# EasyEDA Pro project ProPrj_ 基于stm32制作的PAW3395鼠标_2025-03-07.epro

# Schematic Schematic1
Create Date: 2024-05-16; Page Name: P1; Project Name: 鼠标终极板; Schematic Name: Schematic1; Update Date: 2024-05-30; Company: 嘉立创EDA; Page Size: A4; Version: V1.0
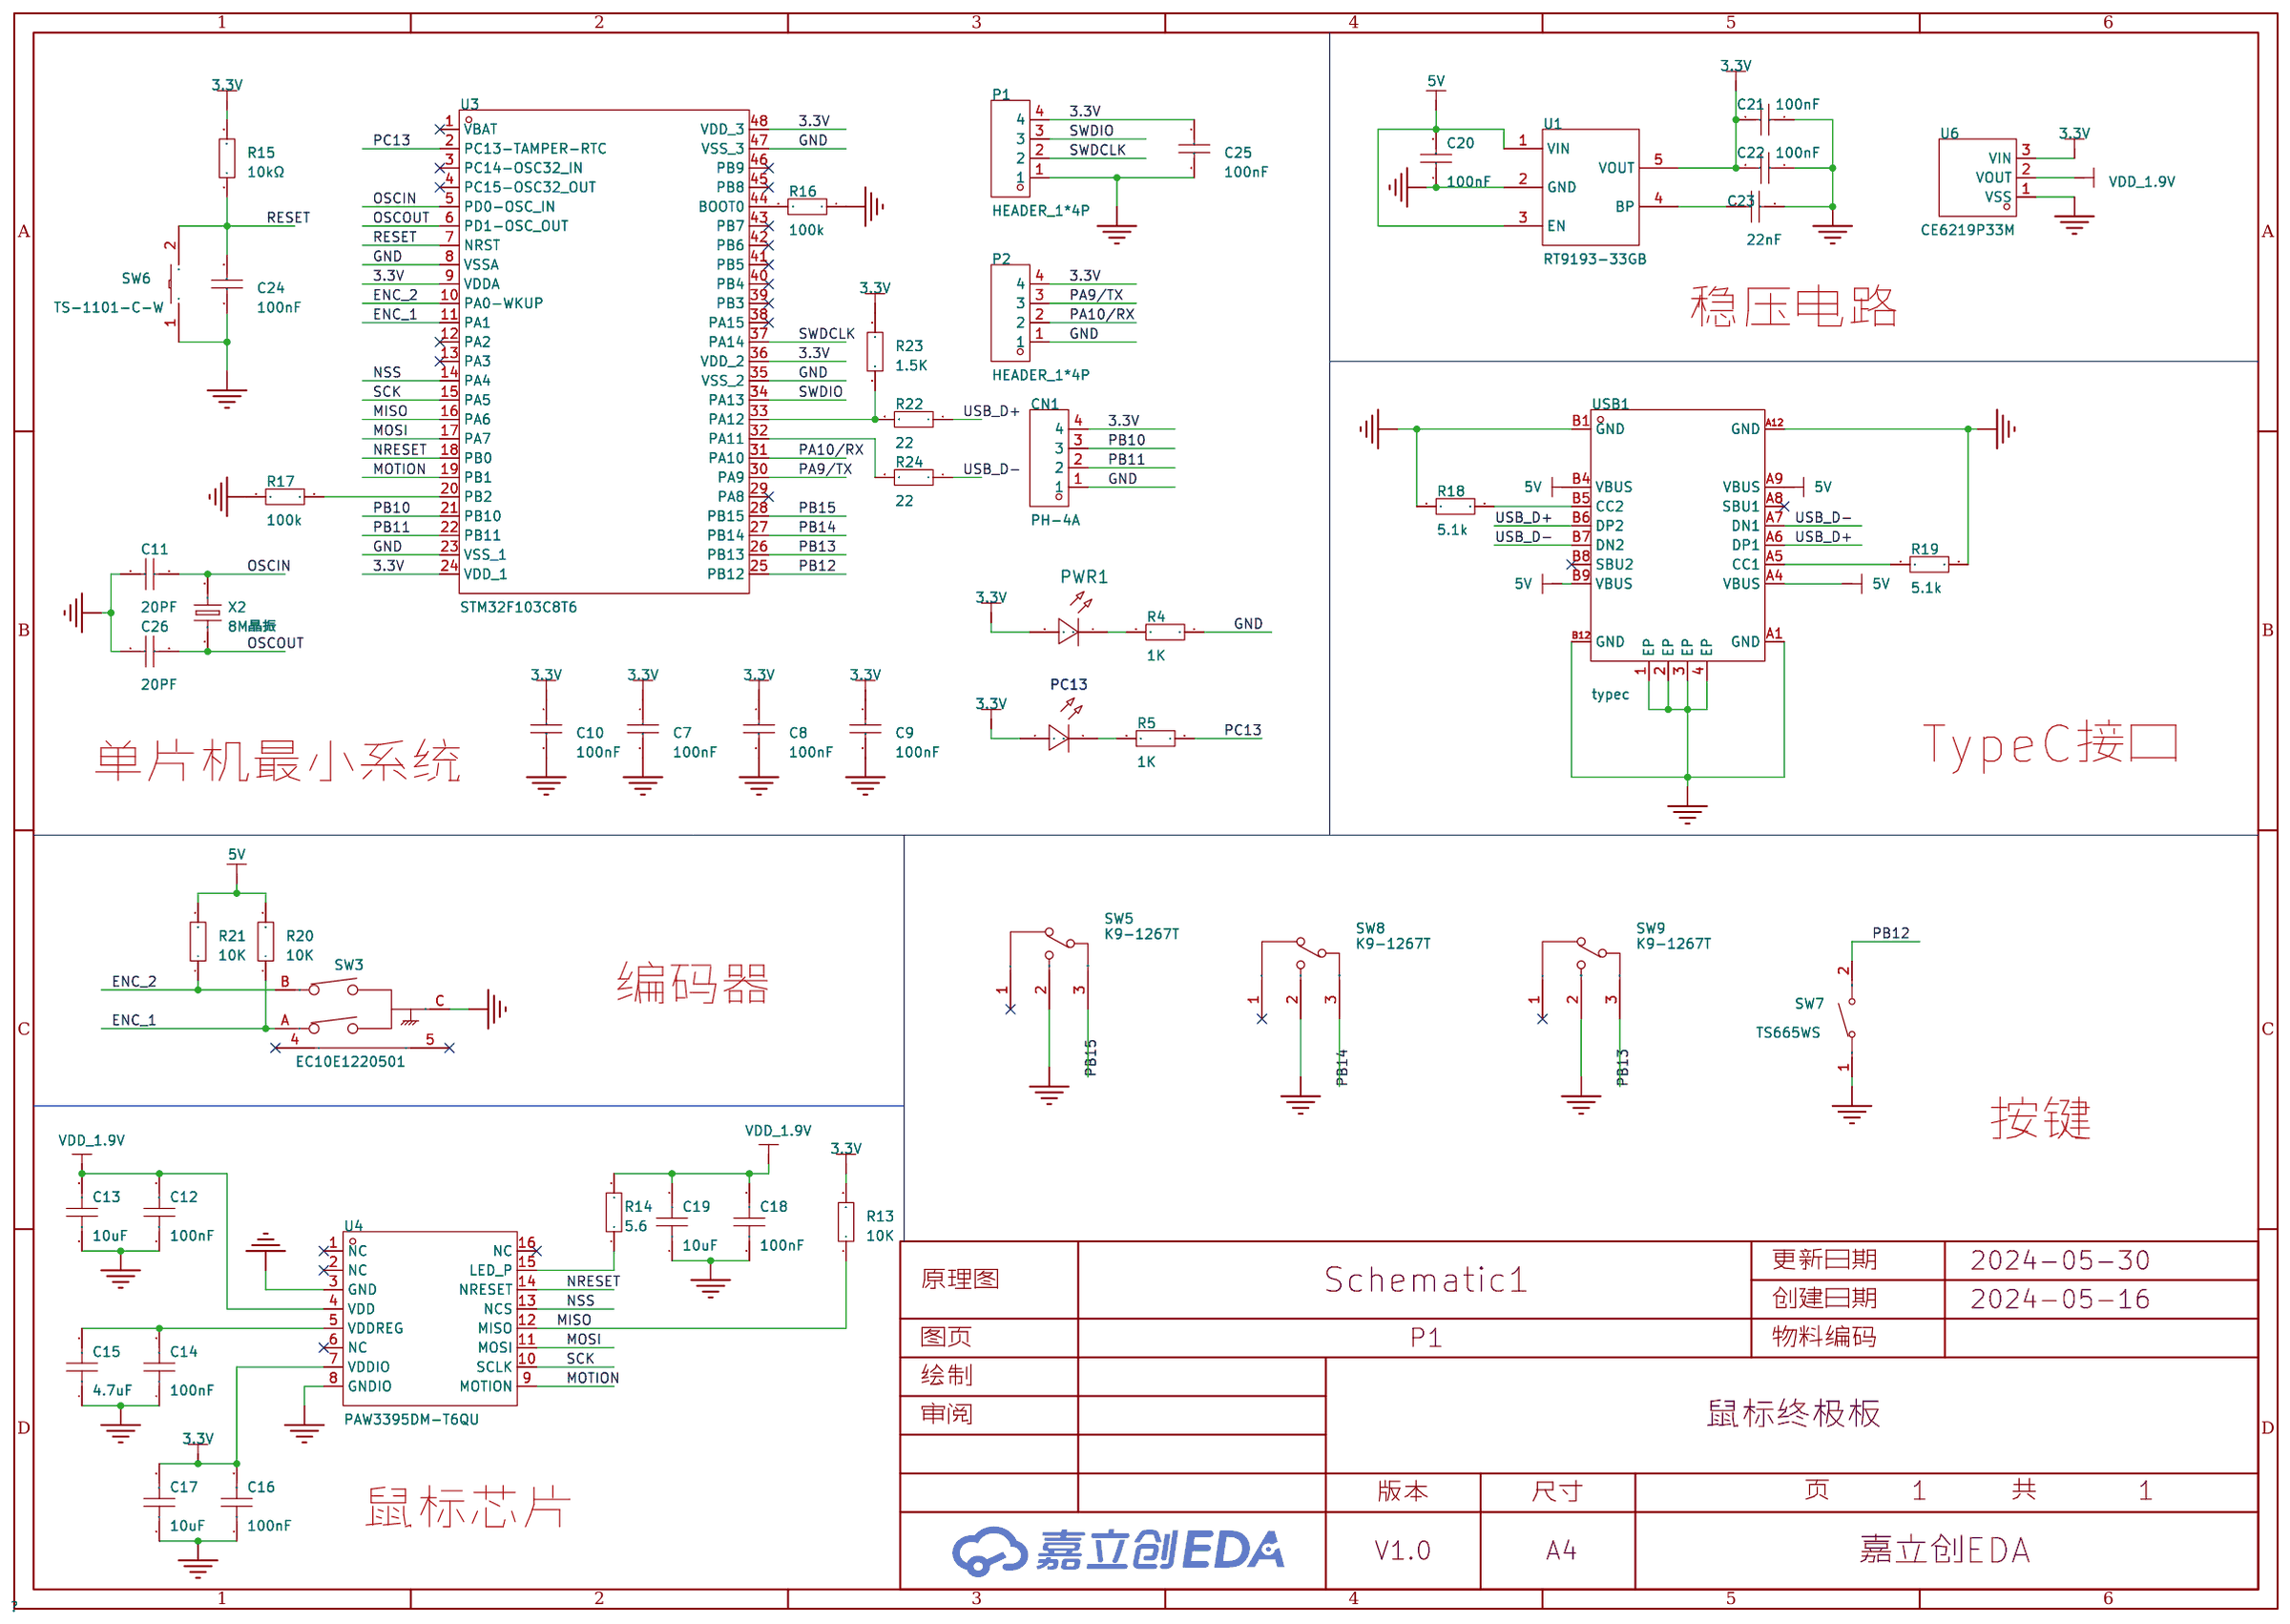
[diagram p0: schematic sheet]

## Parts
C7  100nF  [C0603]
C8  100nF  [C0603]
C9  100nF  [C0603]
C10  100nF  [C0603]
C11  20PF  [C0603]
C12  100nF  [C0603]
C13  10uF  [C0603]
C14  100nF  [C0603]
C15  4.7uF  [C0603]
C16  100nF  [C0603]
C17  10uF  [C0603]
C18  100nF  [C0603]
C19  10uF  [C0603]
C20  100nF  [C0603]
C21  100nF  [C0603]
C22  100nF  [C0603]
C23  22nF  [C0603]
C24  100nF  [C0603]
C25  100nF  [C0603]
C26  20PF  [C0603]
CN1  PH-4A  [CONN-TH_4P-P2.00_PH-4A_C2908625]
P1  HEADER_1*4P  [HDR-TH_4P-P2.54-V-M-1]
P2  HEADER_1*4P  [HDR-TH_4P-P2.54-V-M-1]
PC13  -  [LED_0603]
PWR1  -  [LED_0603]
R4  1K  [R0603]
R5  1K  [R0603]
R13  10K  [R0603]
R14  5.6  [R0603]
R15  10kΩ  [R0603]
R16  100k  [R0603]
R17  100k  [R0603]
R18  5.1k  [R0603]
R19  5.1k  [R0603]
R20  10K  [R0603]
R21  10K  [R0603]
R22  22  [R0603]
R23  1.5K  [R0603]
R24  22  [R0603]
SW3  EC10E1220501  [SW-TH_EC10EXXXXXXX]
SW5  K9-1267T  [SW-TH_K9-1267T]
SW6  TS-1101-C-W  [SW-SMD_L6.0-W3.3-LS8.0]
SW7  TS665WS  [SW-SMD_L6.0-W6.0-LS6.6]
SW8  K9-1267T  [SW-TH_K9-1267T]
SW9  K9-1267T  [SW-TH_K9-1267T]
U1  RT9193-33GB  [SOT-23-5_L3.0-W1.7-P0.95-LS2.8-BL]
U3  STM32F103C8T6  [LQFP-48_L7.0-W7.0-P0.50-LS9.0-BL]
U4  PAW3395DM-T6QU  [DIP-16_PAW3395DM-T6QU]
U6  CE6219P33M  [SOT-23-3_L2.9-W1.6-P1.90-LS2.8-BR]
USB1  typec  [USB-C-SMD_KH-TYPE-C-16P]
X2  8M晶振  [HC-49US_L11.5-W4.5-P4.88]

## Library data of the parts
C7-C11 C20-C26 = 0603B104K500NT: 容值:100nF;精度:±10%;额定电压:50V;材质(温度系数):X7R;; LCSC Part Name: 100nF ±10% 50V; Supplier Part: C30926; Manufacturer: FH(风华); Supplier Footprint: 0603; JLCPCB Part Class: 扩展库; Datasheet: https://atta.szlcsc.com/upload/public/pdf/source/20170923/C30926_1506149436298988724.pdf; Supplier: LCSC; Tolerance: ±10%; Voltage Rated: 50V; Temperature Coefficient: X7R
C12-C19 = CAP_0603: Supplier Footprint: 0603
CN1 = PH-4A_C2908625: 插针结构:1x4P;间距:2mm;安装方式:直插;参考系列:PH;总PIN数:4P;排数:1;每排PIN数:4;行距:-;额定电流:2A;触头材质:黄铜;触头镀层:锡;工作温度范围:-25℃~+85℃;; LCSC Part Name: 1x4P 间距:2mm 直插 系列:PH; Supplier Part: C2908625; Manufacturer: HCTL(华灿天禄); Supplier Footprint: 插件,P=2mm; JLCPCB Part Class: 扩展库; Datasheet: https://atta.szlcsc.com/upload/public/pdf/source/20230707/BA576CECAD32FECA9ECBAF2430E681CE.pdf; Supplier: LCSC; Pins Structure: 1x4P; Pitch: 2mm; Mounting Style: 直插; Reference Series: PH; Number of Pins: 4P; Number of Rows: 1; Number of PINs Per Row: 4; Current Rating (Max): 2A; Contact Material: 黄铜; Contact Plating: 锡; Operating Temperature Range: -25℃~+85℃
P1 P2 = HEADER_1*4P: Supplier Part: C9900003200; Supplier Footprint: TH-4P; JLCPCB Part Class: 扩展库; Datasheet: https://atta.szlcsc.comnull; Supplier: LCSC
PC13 = LED_0603-B: Supplier Footprint: 0603
PWR1 = LED_0603-R: Supplier Footprint: 0603
R4 R5 R15-R17 R22-R24 = 0603WAF1002T5E: 电阻类型:厚膜电阻;阻值:10kΩ;精度:±1%;功率:100mW;; LCSC Part Name: 厚膜电阻 10kΩ ±1% 100mW; Supplier Part: C25804; Manufacturer: UNI-ROYAL(厚声); Supplier Footprint: 0603; JLCPCB Part Class: 基础库; Datasheet: https://atta.szlcsc.com/upload/public/pdf/source/20200306/C422600_1E6D84923E4A46A82E41ADD87F860B5C.pdf; Supplier: LCSC; Type: 厚膜电阻; Tolerance: ±1%; Power(Watts): 100mW; Temperature Coefficient: ±100ppm/℃; Overload Voltage (Max): 75V; Operating Temperature Range: -55℃~+155℃
R13 R14 R18-R21 = Res_0603: Supplier Footprint: 0603
SW3 = EC10E1220501: 10型贯通轴型; Supplier Part: C160889; Manufacturer: ALPSALPINE(阿尔卑斯阿尔派); Supplier Footprint: 插件; JLCPCB Part Class: 扩展库; Datasheet: https://atta.szlcsc.com/upload/public/pdf/source/20180227/C160889_15197014267581370273.pdf; Supplier: LCSC
SW5 SW8 SW9 = K9-1267T: 类型:微动开关;电路结构:单刀双掷;额定电流(DC):100mA;额定电压(DC):30V;额定电流(AC):-;额定电压(AC):-;机械寿命:300万次;; LCSC Part Name: 12.7*5.7*7.5mm 插件微动开关; Supplier Part: C107266; Manufacturer: 韩国韩荣; Supplier Footprint: 插件; JLCPCB Part Class: 扩展库; Datasheet: https://atta.szlcsc.com/upload/public/pdf/source/20170413/1492062748888.pdf; Supplier: LCSC; Type: 微动开关; Circuit: 单刀双掷; Switch Length: 12.7mm; Switch Width: 5.7mm; Switch Height: 7.5mm; Contact Current (DC): 100mA; Voltage Rating (DC): 30V; Mechanical Life: 300万次; Operating Temperature: -25℃~+85℃
SW6 = TS-1101-C-W: 触点电流:50mA;额定电压(AC):-;额定电压(DC):12V;额定功率:-;绝缘电阻:-;电路结构:单刀单掷;安装方式:立贴;带灯:无;作用力:260gf;机械寿命:5万次;带支架:否;; LCSC Part Name: 立贴 6*3.6*2.5mm 轻触开关 一型3*6*2.5有白ZD b拉伸白色带淡绿按键 卷装; Supplier Part: C318938; Manufacturer: XKB Connectivity(中国星坤); Supplier Footprint: SMD; JLCPCB Part Class: 扩展库; Datasheet: https://atta.szlcsc.com/upload/public/pdf/source/20200227/C318938_C2E53B1EEDE37D980A33616AC086DE53.pdf; Supplier: LCSC; Contact Current: 50mA; Voltage Rating (DC): 12V; Circuit: 单刀单掷; Mounting Style: 立贴; Actuator Style: 矩形按钮; Actuator/Cap Color: 白色带淡绿; With Lamp: 无; Operating Force: 260gf; Mechanical Life: 5万次; Operating Temperature: -30℃~+85℃; Switch Length: 6mm; Switch Width: 3.6mm; Switch Height: 2.5mm; Strike Gundam: 否
SW7 = TS665WS_C398058: 电路结构:单刀单掷;按钮形状:圆形按钮;作用力:200gf;安装方式:立贴;开关长度:6mm;开关宽度:6mm;开关高度:5mm;触点电流:50mA;额定电压(DC):12V;带灯:-;机械寿命:-;; LCSC Part Name: 6*6*5mm 立贴 轻触开关; Supplier Part: C398058; Manufacturer: SHOU HAN(首韩); Supplier Footprint: SMD; JLCPCB Part Class: 扩展库; Datasheet: https://atta.szlcsc.com/upload/public/pdf/source/20190620/C398058_75EC11C2CCBC6DD113AE79D58CB25A40.pdf; Supplier: LCSC; Circuit: 单刀单掷; Actuator Style: 圆形按钮; Operating Force: 200gf; Mounting Style: 立贴; Switch Length: 6mm; Switch Width: 6mm; Switch Height: 5mm; Contact Current: 50mA; Voltage Rating (DC): 12V
U1 = RT9193-33GB: 输出类型:固定;输出极性:正;输出通道数:1;最大输入电压:5.5V;输出电压:3.3V;压差:300mV@(300mA);输出电流:300mA;电源纹波抑制比(PSRR):70dB;; LCSC Part Name: 正 Vin=5.5V Vout=3.3V 300mA 70dB; Supplier Part: C15651; Manufacturer: RICHTEK(立锜); Supplier Footprint: SOT-23-5; JLCPCB Part Class: 扩展库; Datasheet: https://atta.szlcsc.com/upload/public/pdf/source/20130730/1457706628575.pdf; Supplier: LCSC; Output Type: 固定; Output Polarity: 正; Number of Outputs: 1; Maximum Input Voltage: 5.5V; Output Voltage: 3.3V; Dropout Voltage: 300mV@(300mA); Output Current: 300mA; Power Supply Rejection Ratio (PSRR): 70dB
U3 = STM32F103C8T6: CPU内核:ARM Cortex-M3;CPU最大主频:72MHz;工作电压范围:2V~3.6V;程序存储容量:64KB;程序存储器类型:FLASH;RAM总容量:20KB;GPIO端口数量:37;; LCSC Part Name: STM32F103C8T6 MSL=3; Supplier Part: C8734; Manufacturer: ST(意法半导体); Supplier Footprint: LQFP-48(7x7); JLCPCB Part Class: 扩展库; Datasheet: https://atta.szlcsc.com/upload/public/pdf/source/20220812/8363ACEC51AD55ECEB84799464F7CB85.pdf; Supplier: LCSC; CPU Core: ARM Cortex-M3; CPU Maximum Speed: 72MHz; Operating Voltage Range: 2V~3.6V; Program Storage Size: 64KB; Program Memory Type: FLASH; RAM Size: 20KB; GPIO Ports Number: 37; ADC (Bit): 12bit; Universal Serial Bus: 有; Peripheral/Function: 看门狗；DMA；看门狗；片载温度传感器; Watchdog: 有; Infrared Data Association: 有; Low-Voltage Detect: 有; Direct Memory Access: 有; Internal Oscillator: 有; Operating Temperature Range: -40℃~+85℃
U4 = PAW3395DM-T6QU: Supplier Part: C9900026543; Supplier Footprint: 16-PDIP; Supplier: LCSC
U6 = CE6219P33M: Supplier Part: C9900023885; Supplier Footprint: SOT-23; JLCPCB Part Class: 扩展库; Supplier: LCSC
USB1 = typec: Supplier Part: C9900016956; Supplier Footprint: typec 12p; JLCPCB Part Class: 扩展库; Supplier: LCSC
X2 = XIHCELNANF-8MHZ: 频率:-;负载电容:-;; LCSC Part Name: 8MHZ 20PF30PPM -40℃~+85℃DIP; Supplier Part: C295088; Manufacturer: TAITIEN(泰艺电子); Supplier Footprint: HC-49S; JLCPCB Part Class: 扩展库; Datasheet: https://atta.szlcsc.com/upload/public/pdf/source/20180928/C295088_870B1C8FD6918B666D832F79126576C6.pdf; Supplier: LCSC

## Nets
3.3V: C7.1 C8.1 C9.1 C10.1 C16.2 C17.2 C21.2 C22.2 C25.1 CN1.4 P1.4 P2.4 PC13.2(A) PWR1.2(A) R13.2 R15.2 R23.1 U1.5(VOUT) U3.9(VDDA) U3.24(VDD_1) U3.36(VDD_2) U3.48(VDD_3) U4.7(VDDIO) U6.3(VIN)
5V: C20.2 R20.2 R21.2 U1.1(VIN) U1.3(EN) USB1.A4(VBUS) USB1.A9(VBUS) USB1.B4(VBUS) USB1.B9(VBUS)
GND: C7.2 C8.2 C9.2 C10.2 C11.1 C12.1 C13.1 C14.1 C15.1 C16.1 C17.1 C18.1 C19.1 C20.1 C21.1 C22.1 C23.1 C24.1 C25.2 C26.1 CN1.1 P1.1 P2.1 R4.1 R16.1 R17.1 R18.1 R19.2 SW3.C SW5.2(ON) SW6.1 SW7.1(A) SW8.2(ON) SW9.2(ON) U1.2(GND) U3.8(VSSA) U3.23(VSS_1) U3.35(VSS_2) U3.47(VSS_3) U4.3(GND) U4.8(GNDIO) U6.1(VSS) USB1.1(EP) USB1.2(EP) USB1.3(EP) USB1.4(EP) USB1.A1(GND) USB1.A12(GND) USB1.B1(GND) USB1.B12(GND)
VDD_1.9V: C12.2 C13.2 C18.2 C19.2 R14.2 U4.4(VDD) U6.2(VOUT)
ENC_1: R20.1 SW3.A U3.11(PA1)
ENC_2: R21.1 SW3.B U3.10(PA0-WKUP)
MISO: R13.1 U3.16(PA6) U4.12(MISO)
MOSI: U3.17(PA7) U4.11(MOSI)
MOTION: U3.19(PB1) U4.9(MOTION)
NRESET: U3.18(PB0) U4.14(NRESET)
NSS: U3.14(PA4) U4.13(NCS)
OSCIN: C11.2 U3.5(PD0-OSC_IN) X2.2
OSCOUT: C26.2 U3.6(PD1-OSC_OUT) X2.1
PA9/TX: P2.3 U3.30(PA9)
PA10/RX: P2.2 U3.31(PA10)
PB10: CN1.3 U3.21(PB10)
PB11: CN1.2 U3.22(PB11)
PB12: SW7.2(B) U3.25(PB12)
PB13: SW9.3(NC) U3.26(PB13)
PB14: SW8.3(NC) U3.27(PB14)
PB15: SW5.3(NC) U3.28(PB15)
PC13: R5.1 U3.2(PC13-TAMPER-RTC)
RESET: C24.2 R15.1 SW6.2 U3.7(NRST)
SCK: U3.15(PA5) U4.10(SCLK)
SWDCLK: P1.2 U3.37(PA14)
SWDIO: P1.3 U3.34(PA13)
USB_D+: R22.1 USB1.A6(DP1) USB1.B6(DP2)
USB_D-: R24.1 USB1.A7(DN1) USB1.B7(DN2)
$1N305: R22.2 R23.2 U3.33(PA12)
$1N307: R24.2 U3.32(PA11)
$1N931: C14.2 C15.2 U4.5(VDDREG)
$1N949: R14.1 U4.15(LED_P)
$1N1765: C23.2 U1.4(BP)
$1N2049: R16.2 U3.44(BOOT0)
$1N2683: PWR1.1(C) R4.2
$1N2684: PC13.1(C) R5.2
$1N2744: R17.2 U3.20(PB2)
$1N4926: R18.2 USB1.B5(CC2)
$1N5073: R19.1 USB1.A5(CC1)

Not connected (* = marked no-connect by the designer): SW3 4* 5*; SW5 1(C)*; SW8 1(C)*; SW9 1(C)*; U3 1(VBAT)* 3(PC14-OSC32_IN)* 4(PC15-OSC32_OUT)* 12(PA2)* 13(PA3)* 29(PA8)* 38(PA15)* 39(PB3)* 40(PB4)* 41(PB5)* 42(PB6)* 43(PB7)* 45(PB8)* 46(PB9)*; U4 1(NC)* 2(NC)* 6(NC)* 16(NC)*; USB1 A8(SBU1)* B8(SBU2)*

## Notes on the sheet
- 稳压电路
- TypeC接口
- 单片机最小系统
- 编码器
- 按键
- 鼠标芯片

# Board PCB1
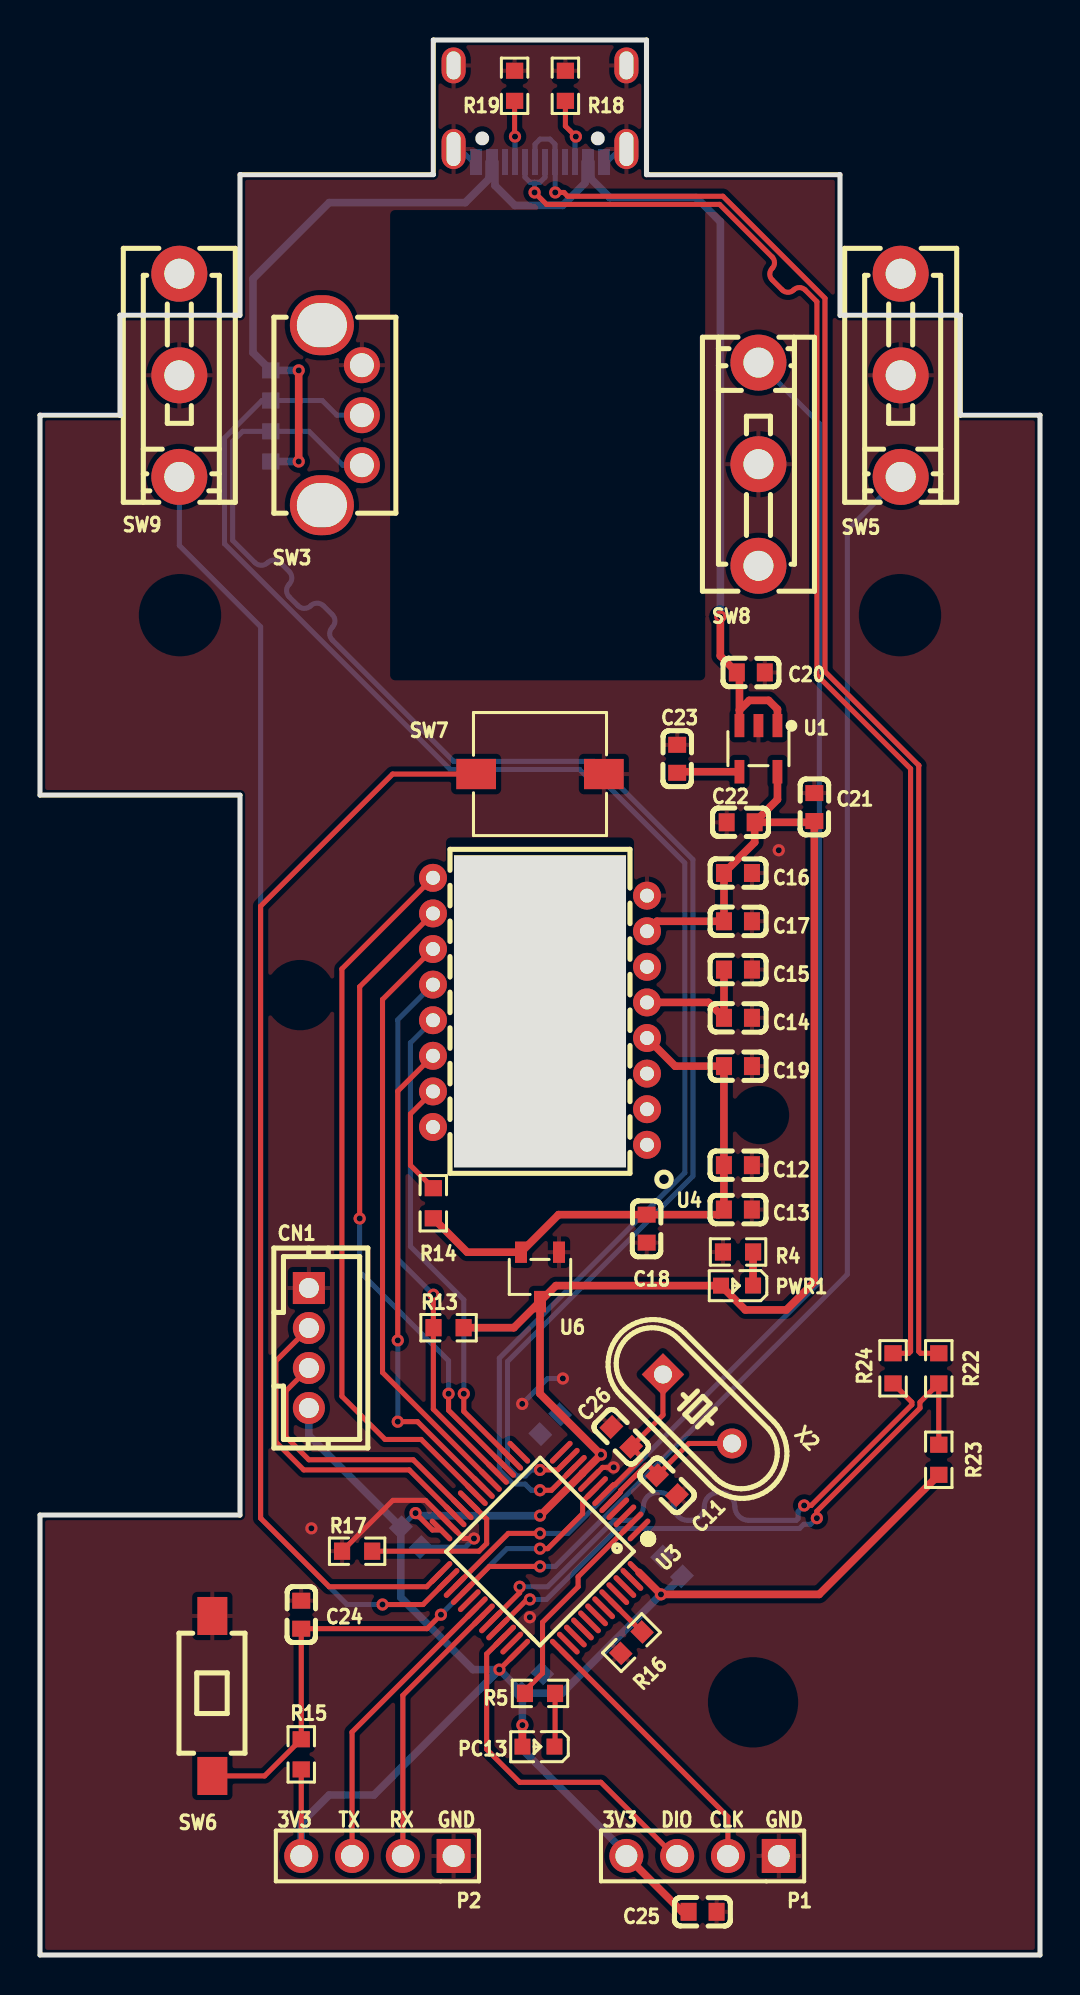
[diagram p1: board, top side]
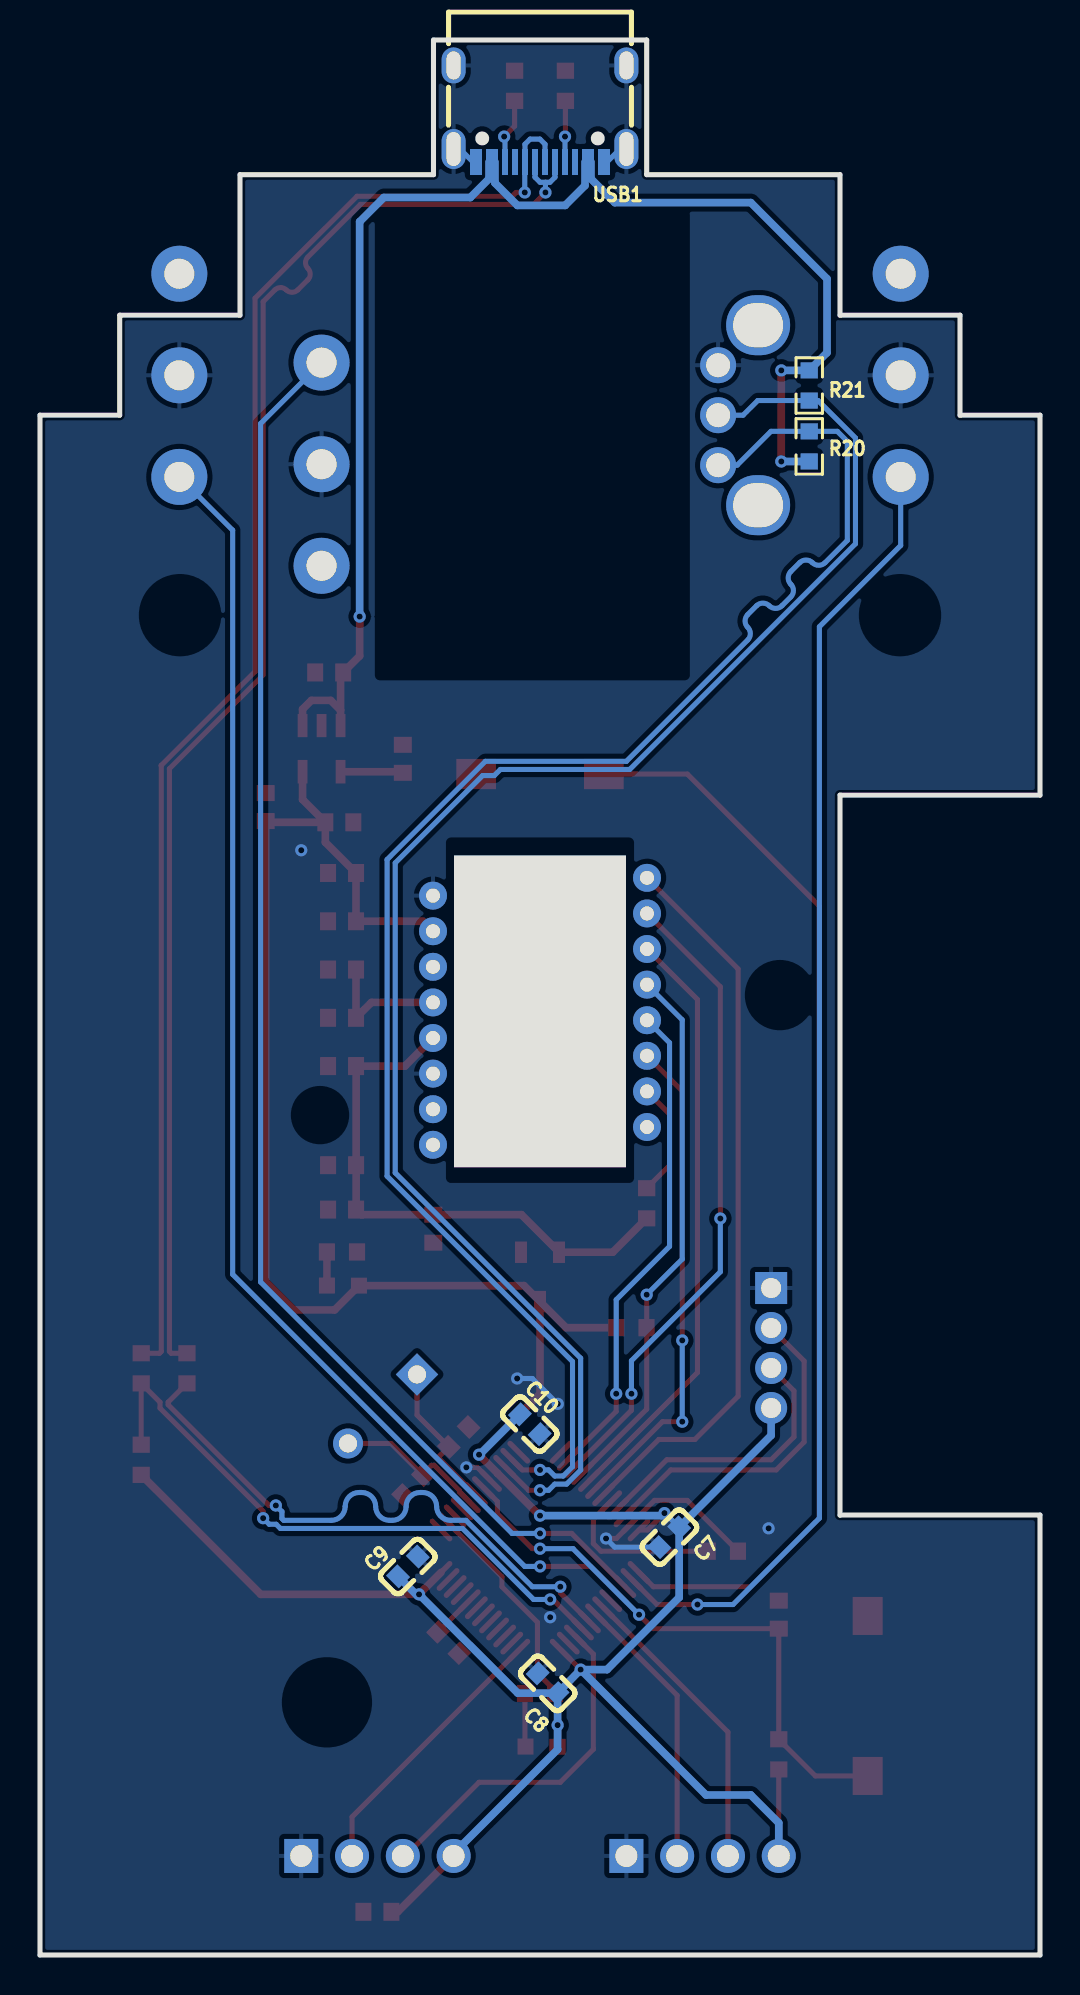
[diagram p2: board, bottom side, seen from below]

Outline 50 x 95.76 mm; copper layers: Top Layer, Bottom Layer. Coordinates in mm from the lower left corner of the outline.
Outline path: 0,77 4,77 4,82 10,82 10,89.03 19.67,89.03 19.67,95.76 30.33,95.76 30.33,89.03 40,89.03 40,82 46.02,82 46.02,77 50,77 50,0 0,0 0,22 10,22 10,58 0,58 0,77
Stack: Top Layer 0.035mm / Dielectric1 1.51mm FR4 er 4.5 / Bottom Layer 0.035mm

## Design rules (mm)
net OSCIN: DP1
net OSCOUT: DP1
net ENC_2: DP2
net ENC_1: DP2
net USB_D-: DP3
net USB_D+: DP3
net $1N307: DP4
net $1N305: DP4
template: JLCPCB Capability(Two Layers Board)
spacing copperThickness1oz (default): track to track 0.102, other pairs 0.152 to 0.3
spacing copperThickness2oz: track to track 0.203, other pairs 0.152 to 0.3
track width copperThickness1oz (default): min 0.127, default 0.254, max 2.54
track width copperThickness2oz: min 0.203, default 0.254, max 2.54
differential pair differentialPair (default): width min 0.127, default 0.254, max 2.54; gap min 0.152, default 0.152
via viaSize (default): diameter min 0.5, default 0.61, max 10; hole min 0.3, default 0.305, max 6.3

## Placement (name value [footprint] x y rotation side)
C7  100nF  [C0603]  18.54 20.89 315 bottom
C8  100nF  [C0603]  24.62 13.59 45 bottom
C9  100nF  [C0603]  31.6 19.43 135 bottom
C10  100nF  [C0603]  25.51 26.54 225 bottom
C11  20PF  [C0603]  31.35 23.5 135 top
C12  100nF  [C0603]  34.89 39.5 180 top
C13  10uF  [C0603]  34.89 37.28 180 top
C14  100nF  [C0603]  34.9 46.86 180 top
C15  4.7uF  [C0603]  34.9 49.28 180 top
C16  100nF  [C0603]  34.9 54.11 180 top
C17  10uF  [C0603]  34.9 51.69 180 top
C18  100nF  [C0603]  30.33 36.32 90 top
C19  10uF  [C0603]  34.9 44.45 180 top
C20  100nF  [C0603]  35.54 64.14 180 top
C21  100nF  [C0603]  38.72 57.4 270 top
C22  100nF  [C0603]  35.03 56.64 0 top
C23  22nF  [C0603]  31.86 59.82 270 top
C24  100nF  [C0603]  13.06 17.02 270 top
C25  100nF  [C0603]  33.13 2.16 0 top
C26  20PF  [C0603]  29.06 25.91 315 top
CN1  PH-4A  [CONN-TH_4P-P2.00_PH-4A_C2908625]  13.44 30.35 270 top
P1  HEADER_1*4P  [HDR-TH_4P-P2.54-V-M-1]  33.13 4.95 180 top
P2  HEADER_1*4P  [HDR-TH_4P-P2.54-V-M-1]  16.87 4.95 180 top
PC13  -  [LED_0603]  24.87 10.41 180 top
PWR1  -  [LED_0603]  34.8 33.47 180 top
R4  1K  [R0603]  34.9 35.16 0 top
R5  1K  [R0603]  25 13.08 0 top
R13  10K  [R0603]  20.43 31.37 0 top
R14  5.6  [R0603]  19.67 37.59 270 top
R15  10kΩ  [R0603]  13.06 10.03 270 top
R16  100k  [R0603]  29.57 15.62 45 top
R17  100k  [R0603]  15.86 20.19 0 top
R18  5.1k  [R0603]  26.27 93.47 270 top
R19  5.1k  [R0603]  23.73 93.47 90 top
R20  10K  [R0603]  11.54 75.44 270 bottom
R21  10K  [R0603]  11.54 78.49 90 bottom
R22  22  [R0603]  44.94 29.34 270 top
R23  1.5K  [R0603]  44.94 24.77 90 top
R24  22  [R0603]  42.65 29.34 270 top
SW3  EC10E1220501  [SW-TH_EC10EXXXXXXX]  15.09 77 90 top
SW5  K9-1267T  [SW-TH_K9-1267T]  43.03 78.99 270 top
SW6  TS-1101-C-W  [SW-SMD_L6.0-W3.3-LS8.0]  8.62 12.95 270 top
SW7  TS665WS  [SW-SMD_L6.0-W6.0-LS6.6]  25 59.06 180 top
SW8  K9-1267T  [SW-TH_K9-1267T]  35.92 74.55 90 top
SW9  K9-1267T  [SW-TH_K9-1267T]  6.97 78.99 270 top
U1  RT9193-33GB  [SOT-23-5_L3.0-W1.7-P0.95-LS2.8-BL]  35.92 60.33 180 top
U3  STM32F103C8T6  [LQFP-48_L7.0-W7.0-P0.50-LS9.0-BL]  25 20.19 135 top
U4  PAW3395DM-T6QU  [DIP-16_PAW3395DM-T6QU]  25 47.19 180 top
U6  CE6219P33M  [SOT-23-3_L2.9-W1.6-P1.90-LS2.8-BR]  25 33.91 90 top
USB1  typec  [USB-C-SMD_KH-TYPE-C-16P]  25 92.08 0 bottom
X2  8M晶振  [HC-49US_L11.5-W4.5-P4.88]  32.87 27.31 315 top

## Footprints (pads in the part's own frame, mm; a bottom-side part is the same pattern mirrored in y, then rotated)
C0603
  rect 0.8x0.9 smd: 1(-0.7,0) 2(0.7,0)
CONN-TH_4P-P2.00_PH-4A_C2908625
  rect 1.6x1.6 hole 1: 1(-3,0)
  round 1.6 hole 1: 2(-1,0) 3(1,0) 4(3,0)
DIP-16_PAW3395DM-T6QU
  round 1.4 hole 0.7: 1(-5.35,6.675) 2(-5.35,4.895) 3(-5.35,3.115) 4(-5.35,1.335) 5(-5.35,-0.445) 6(-5.35,-2.225) 7(-5.35,-4.005) 8(-5.35,-5.785) 9(5.35,-6.675) 10(5.35,-4.895) 11(5.35,-3.115) 12(5.35,-1.335) 13(5.35,0.445) 14(5.35,2.225) 15(5.35,4.005) 16(5.35,5.785)
HC-49US_L11.5-W4.5-P4.88
  rect 1.5x1.5 hole 0.9: 1(-2.44,0)
  round 1.5 hole 0.9: 2(2.44,0)
HDR-TH_4P-P2.54-V-M-1
  rect 1.7x1.7 hole 1.1: 1(-3.81,0)
  round 1.7 hole 1.1: 2(-1.27,0) 3(1.27,0) 4(3.81,0)
LED_0603
  rect 0.8x0.8 smd: 1(-0.851,-0.01) 2(0.75,-0.005)
LQFP-48_L7.0-W7.0-P0.50-LS9.0-BL
  oval 0.27x1.5 smd: 1(-2.75,-4.25) 2(-2.25,-4.25) 3(-1.75,-4.25) 4(-1.25,-4.25) 5(-0.75,-4.25) 6(-0.25,-4.25) 7(0.25,-4.25) 8(0.75,-4.25) 9(1.25,-4.25) 10(1.75,-4.25) 11(2.25,-4.25) 12(2.75,-4.25) 25(2.75,4.25) 26(2.25,4.25) 27(1.75,4.25) 28(1.25,4.25) 29(0.75,4.25) 30(0.25,4.25) 31(-0.25,4.25) 32(-0.75,4.25) 33(-1.25,4.25) 34(-1.75,4.25) 35(-2.25,4.25) 36(-2.75,4.25)
  oval 1.5x0.27 smd: 13(4.25,-2.75) 14(4.25,-2.25) 15(4.25,-1.75) 16(4.25,-1.25) 17(4.25,-0.75) 18(4.25,-0.25) 19(4.25,0.25) 20(4.25,0.75) 21(4.25,1.25) 22(4.25,1.75) 23(4.25,2.25) 24(4.25,2.75) 37(-4.25,2.75) 38(-4.25,2.25) 39(-4.25,1.75) 40(-4.25,1.25) 41(-4.25,0.75) 42(-4.25,0.25) 43(-4.25,-0.25) 44(-4.25,-0.75) 45(-4.25,-1.25) 46(-4.25,-1.75) 47(-4.25,-2.25) 48(-4.25,-2.75)
R0603
  rect 0.806x0.864 smd: 1(-0.753,0) 2(0.753,0)
SOT-23-3_L2.9-W1.6-P1.90-LS2.8-BR
  rect 1.07x0.6 smd: 1(1.235,-0.95) 2(1.235,0.95) 3(-1.235,0)
SOT-23-5_L3.0-W1.7-P0.95-LS2.8-BL
  rect 0.49x1.157 smd: 1(-0.95,-1.153) 2(0,-1.153) 3(0.95,-1.153)
  rect 0.49x1.175 smd: 4(0.95,1.153) 5(-0.95,1.153)
SW-SMD_L6.0-W3.3-LS8.0
  rect 1.9x1.5 smd: 1(-4,0) 2(4,0)
SW-SMD_L6.0-W6.0-LS6.6
  rect 1.985x1.512 smd: 1(-3.192,0) 2(3.192,0)
SW-TH_EC10EXXXXXXX
  oval 3x3.2 hole 2.2x2.5: 4(-4.5,1) 5(4.5,1)
  round 1.8 hole 1.2: A(-2.5,-1) B(0,-1) C(2.5,-1)
SW-TH_K9-1267T
  round 2.8 hole 1.5: 1(-5.08,0) 2(0,0) 3(5.08,0)
USB-C-SMD_KH-TYPE-C-16P
  oval 1.2x2 hole 0.7x1.7: 1(-4.32,1.765) 2(4.32,1.765)
  oval 1.2x1.8 hole 0.7x1.4: 3(-4.32,-2.415) 4(4.32,-2.415)
  rect 0.3x1.3 smd: A1(-3.35,2.415) A4(-2.55,2.415) A5(-1.25,2.415) A6(-0.25,2.415) A7(0.25,2.415) A8(1.25,2.415) A9(2.55,2.415) A12(3.35,2.415) B1(3.05,2.415) B4(2.25,2.415) B5(1.75,2.415) B6(0.75,2.415) B7(-0.75,2.415) B8(-1.75,2.415) B9(-2.25,2.415) B12(-3.05,2.415)

## Nets
As in the schematic.

Pads without a net: SW3 4 5; SW5 1; SW8 1; SW9 1; U3 1 3 4 12 13 29 38 39 40 41 42 43 45 46; U4 1 2 6 16; USB1 A8 B8

## Via types
v1: diameter 0.61, hole 0.305, Top Layer to Bottom Layer, 37 vias

## Routing (per net, layer and track width the routed paths; a pad name or vN(x,y) marks a point on that pad's centre or on a via; arc(x,y) is an arc through that point)
3.3V: length 166.9
  Top Layer w0.254: U3.24 19.62,21.25 v1(18.78,22.1) ; U3.36 v1(22.97,14.27) ; P2.4 R15.2
  Top Layer w0.381: v1(25,21.97) 25.01,21.97 U3.9 27.12,24.09 v1(28.05,25.02) 25,28.07 U6.3 ; R13.2 23.69,31.37 U6.3 ; U6.3 25.8,33.47 PWR1.2 35.27,32.26 37.32,32.26 38.72,33.66 38.72,56.58 ; C22.2 35.73,55.64 C16.2 C17.2 30.85,51.69 U4.7 ; C22.2 36.87,57.78 U1.5 ; C22.2 38.65,56.64 38.72,56.58 ; P1.4 32.11,2.16 C25.1 ; 38.72,56.58 C21.2 ; 24.12,10.42 24.12,10.42 v1(24.12,11.5) ; U3.48 v1(31.05,18.03) 38.96,18.03 R23.1
  Bottom Layer w0.254: v1(18.78,22.1) 18.75,22.1 18.04,21.39
  Bottom Layer w0.381: CN1.4 13.44,25.98 18.04,21.39 18.04,17.88 21.65,14.27 v1(22.97,14.27) ; v1(22.97,14.27) 16.7,8 14.46,8 13.06,6.6 P2.4 ; v1(22.97,14.27) 24.12,13.09 ; 24.12,13.09 v1(24.12,11.5) 24.12,10.28 29.08,5.32 29.08,5.06 ; 24.12,13.09 C8.1 26.11,13.09 v1(31.05,18.03) 31.2,18.03 32.1,18.94 ; 26,27.04 28.02,25.02 v1(28.05,25.02) ; v1(25,21.97) 18.9,21.97 v1(18.78,22.1)
5V: length 71.5
  Top Layer w0.381: 34.97,62.25 34.97,64 C20.2 34.02,64.96 v1(34.02,66.93) ; 34.97,62.25 U1.3 ; 34.97,62.25 35.46,62.74 36.43,62.74 36.87,62.3 U1.1 ; v1(12.94,74.68) v1(12.94,79.24)
  Bottom Layer w0.381: USB1.A4 22.45,88.82 21.26,87.63 14.46,87.63 10.65,83.82 10.65,80.13 R21.2 v1(12.94,79.24) ; R20.2 v1(12.94,74.68) ; USB1.B9 22.75,88.48 23.74,87.49 26.13,87.49 27.25,88.61 USB1.B4 ; v1(34.02,66.93) 34.02,86.68 32.81,87.88 28.49,87.88 27.55,88.82 USB1.A9
GND: length 17.8
  Top Layer w0.254: 27.47,23.73 28.13,24.38 v1(28.68,24.38) ; v1(21.7,20.83) 21.18,20.83 U3.23 19.28,22.73 17.64,22.73 R17.1
  Bottom Layer w0.254: v1(21.7,20.83) 21.27,20.4 19.03,20.4 ; USB1.1 21,90.31 USB1.A1 ; v1(24.11,27.56) 25.38,28.83 v1(26.14,28.83) ; USB1.2 29,90.31 USB1.A12
  vias: v1(13.57,21.34) v1(24.49,16.89) v1(36.94,55.25)
VDD_1.9V: length 27.7
  Top Layer w0.381: R14.2 21.36,35.14 U6.2 25.93,37.02 C18.2 33.94,37.02 C13.2 C12.2 34.19,44.45 C19.2 31.75,44.45 U4.4
ENC_1: length 80.9
  Top Layer w0.254: 26.41,24.79 25.88,24.26 v1(25,24.26)
  Bottom Layer w0.254: 15.21,74.5 15.14,74.5 13.45,76.19 R20.1 10.13,76.19 9.63,75.69 9.63,70.74 10.75,69.63 arc(11.06,69.49) 11.38,69.63 arc(11.7,69.76) 12.02,69.63 12.46,69.18 arc(12.59,68.86) 12.46,68.55 arc(12.33,68.23) 12.46,67.91 12.9,67.47 arc(13.22,67.34) 13.54,67.47 arc(13.85,67.6) 14.17,67.47 14.61,67.03 arc(14.75,66.71) 14.61,66.39 arc(14.48,66.08) 14.61,65.76 20.68,59.69 27.73,59.69 32.65,54.78 32.65,38.95 23.37,29.68 23.37,24.42 23.84,23.95 24.26,23.95 24.57,24.26 v1(25,24.26)
ENC_2: length 80.9
  Top Layer w0.254: v1(25,23.24) 25.57,23.24 U3.10
  Bottom Layer w0.254: 15.21,77 14.85,77 14.11,77.73 R21.1 11.1,77.73 9.23,75.86 9.23,70.57 20.51,59.28 26.98,59.28 27.29,58.98 27.87,58.98 32.24,54.61 32.24,39.12 22.97,29.84 22.97,24.25 23.67,23.55 24.26,23.55 24.57,23.24 v1(25,23.24)
MISO: length 27.2
  Top Layer w0.254: v1(19.67,33.02) 19.67,27.29 U3.16
  Bottom Layer w0.254: U4.12 17.89,46.76 17.89,34.8 v1(19.67,33.02)
MOSI: length 29.9
  Top Layer w0.254: U4.11 17.13,47.78 17.13,29.13 22.53,23.73
MOTION: length 36.6
  Top Layer w0.254: U3.19 19.06,25.78 17.25,25.78 15.09,27.94 15.09,49.31 U4.9
NRESET: length 24.7
  Top Layer w0.254: 22.17,23.38 18.88,26.67 v1(17.89,26.67) ; v1(17.89,30.73) 17.89,43.2 U4.14
  Bottom Layer w0.254: v1(17.89,26.67) v1(17.89,30.73)
NSS: length 24.5
  Top Layer w0.254: 23.59,24.79 21.19,27.19 v1(21.19,28.07)
  Bottom Layer w0.254: U4.13 18.52,45.62 18.52,35.43 21.19,32.77 v1(21.19,28.07)
OSCIN: length 7.8
  Top Layer w0.254: X2.2 32.44,25.58 C11.2 30.85,24.05 30.42,24.49 30.29,24.49 29.03,23.23 29.03,23.16 U3.5
OSCOUT: length 7.7
  Top Layer w0.254: X2.1 31.15,27 29.56,25.41 30.04,24.94 30.04,24.81 28.74,23.51 28.67,23.51 U3.6
PA9/TX: length 15
  Top Layer w0.254: U3.30 15.6,11.15 P2.3
PA10/RX: length 13.7
  Top Layer w0.254: U3.31 18.14,12.98 P2.2
PB10: length 14.2
  Top Layer w0.254: 21.11,22.31 18.66,24.77 13.44,24.77 12.3,25.91 12.3,28.21 CN1.3
PB11: length 16.9
  Top Layer w0.254: U3.22 18.46,24.26 13.19,24.26 11.79,25.65 11.79,29.7 CN1.2
PB12: length 54.5
  Top Layer w0.254: U3.25 19.33,18.41 14.46,18.41 11.03,21.84 11.03,52.45 17.63,59.06 21.43,59.06
PB13: length 65.4
  Top Layer w0.254: 20.4,18.78 19.15,17.53 v1(17.13,17.53)
  Bottom Layer w0.254: v1(17.13,17.53) 15.35,17.53 11.03,21.84 11.03,66.42 6.97,70.48 SW9.3
PB14: length 71.8
  Top Layer w0.254: U3.27 23.41,21.08 v1(25,21.08)
  Bottom Layer w0.254: SW8.3 38.97,76.58 38.97,33.66 26.4,21.08 v1(25,21.08)
PB15: length 66.9
  Top Layer w0.254: v1(25,19.43) 22.47,19.43 21.11,18.07
  Bottom Layer w0.254: SW5.3 40.37,71.25 40.37,34.04 25.76,19.43 v1(25,19.43)
PC13: length 10.8
  Top Layer w0.254: 24.12,13.09 25.13,14.1 25.13,16.64 26.91,18.41 26.91,18.92 U3.2
RESET: length 28.8
  Top Layer w0.254: v1(20.05,17.02) 19.35,16.32 C24.2 R15.1 11.23,8.95 SW6.2 ; v1(25,20.32) 25.38,20.32 27.13,22.07 27.13,22.68 27.83,23.38
  Bottom Layer w0.254: v1(25,20.32) 23.35,20.32 v1(20.05,17.02)
SCK: length 32.2
  Top Layer w0.254: U3.15 20.43,27.24 v1(20.43,28.07) ; U4.10 15.98,48.42 v1(15.98,36.83)
  Bottom Layer w0.254: v1(15.98,36.83) 15.98,34.16 20.43,29.72 v1(20.43,28.07)
SWDCLK: length 13.7
  Top Layer w0.254: U3.37 34.4,6.91 34.4,5.3 34.16,5.06
SWDIO: length 17.5
  Top Layer w0.254: U3.34 22.33,15.05 22.33,10.29 23.98,8.64 28.05,8.64 31.62,5.07 31.62,5.06
USB_D+: length 75.9
  Top Layer w0.254: v1(25.76,88.14) 26.19,88.14 26.38,87.95 34.15,87.95 39.25,82.85 39.25,64.18 43.94,59.49 ; 43.94,59.49 43.94,30.18 44.03,30.09 R22.1 ; 43.94,59.49 43.95,59.48
  Bottom Layer w0.254: USB1.A6 24.75,90.55 25,90.81 25.5,90.81 25.75,90.55 USB1.B6 25.76,89.65 v1(25.76,88.14)
USB_D-: length 75.9
  Top Layer w0.254: v1(24.73,88.14) 25.32,87.54 33.98,87.54 36.61,84.91 arc(36.73,84.63) 36.61,84.34 arc(36.49,84.06) 36.61,83.77 37.11,83.26 arc(37.4,83.14) 37.69,83.26 arc(37.97,83.38) 38.26,83.26 38.84,82.68 38.84,64.01 43.53,59.32 43.53,30.18 43.44,30.09 R24.1
  Bottom Layer w0.254: 24.73,88.65 25,88.65 25.25,88.9 USB1.A7 ; 24.73,88.65 v1(24.73,88.14) ; 24.73,88.65 24.5,88.65 24.25,88.9 USB1.B7
$1N305: length 30.6
  Top Layer w0.254: v1(24.49,17.78) 24.35,17.78 U3.33 ; v1(38.84,21.84) 38.84,22.19 44,27.35 44,27.64 R22.2 R23.2
  Bottom Layer w0.254: v1(38.84,21.84) 38.54,21.54 38.19,21.54 37.98,21.33 28.87,21.33 25.32,17.78 v1(24.49,17.78)
$1N307: length 30.6
  Top Layer w0.254: 22.53,16.66 23.98,18.12 v1(23.98,18.41) ; R24.2 43.59,27.64 43.59,27.52 38.56,22.48 v1(38.21,22.48)
  Bottom Layer w0.254: v1(23.98,18.41) 25.38,18.41 28.7,21.74 29.47,21.74 arc(29.97,21.94) 30.17,22.43 arc(30.37,22.92) 30.87,23.13 31,23.13 arc(31.49,22.92) 31.69,22.43 arc(31.9,21.94) 32.39,21.74 32.52,21.74 arc(33.01,21.94) 33.22,22.43 arc(33.42,22.92) 33.91,23.13 34.05,23.13 arc(34.54,22.92) 34.74,22.43 arc(34.95,21.94) 35.44,21.74 37.81,21.74 37.9,21.83 37.9,22.17 v1(38.21,22.48)
$1N931: length 6.6
  Top Layer w0.381: C15.2 C14.2 33.43,47.64 30.35,47.64
$1N949: length 5.8
  Top Layer w0.254: U4.15 18.52,42.06 18.52,39.49 R14.1
$1N1765: length 3.1
  Top Layer w0.381: C23.2 31.91,59.17 U1.4
$1N2049: length 2.2
  Top Layer w0.254: U3.44 30.1,16.15 R16.2
$1N2683: length 1.7
  Top Layer w0.381: PWR1.1 35.65,35.15 R4.2
$1N2684: length 2.7
  Top Layer w0.254: PC13.1 25.75,10.45 R5.2
$1N2744: length 8.3
  Top Layer w0.254: R17.2 21.95,20.19 22.33,20.57 22.33,21.8 U3.20
$1N4926: length 3.3
  Top Layer w0.254: R18.2 26.27,91.45 v1(26.79,90.93)
  Bottom Layer w0.254: USB1.B5 26.75,90.93
$1N5073: length 3.1
  Top Layer w0.254: R19.1 23.73,90.95 v1(23.75,90.93)
  Bottom Layer w0.254: USB1.A5 v1(23.75,90.93)

## Copper pours and planes (outline as drawn; the poured copper is in the pictures)
GND on Top Layer: -0.02,95.76 50,95.76 50,0 -0.02,0
GND on Bottom Layer: -0.02,95.76 50,95.76 50,0 -0.02,0

## Text on the board
Top Silkscreen Layer: 3V3 | TX | RX | GND | DIO | CLK
